# EAGLE schematic InkTime_Schematic (EAGLE 9.7.0)

## Sheet 1 of 2
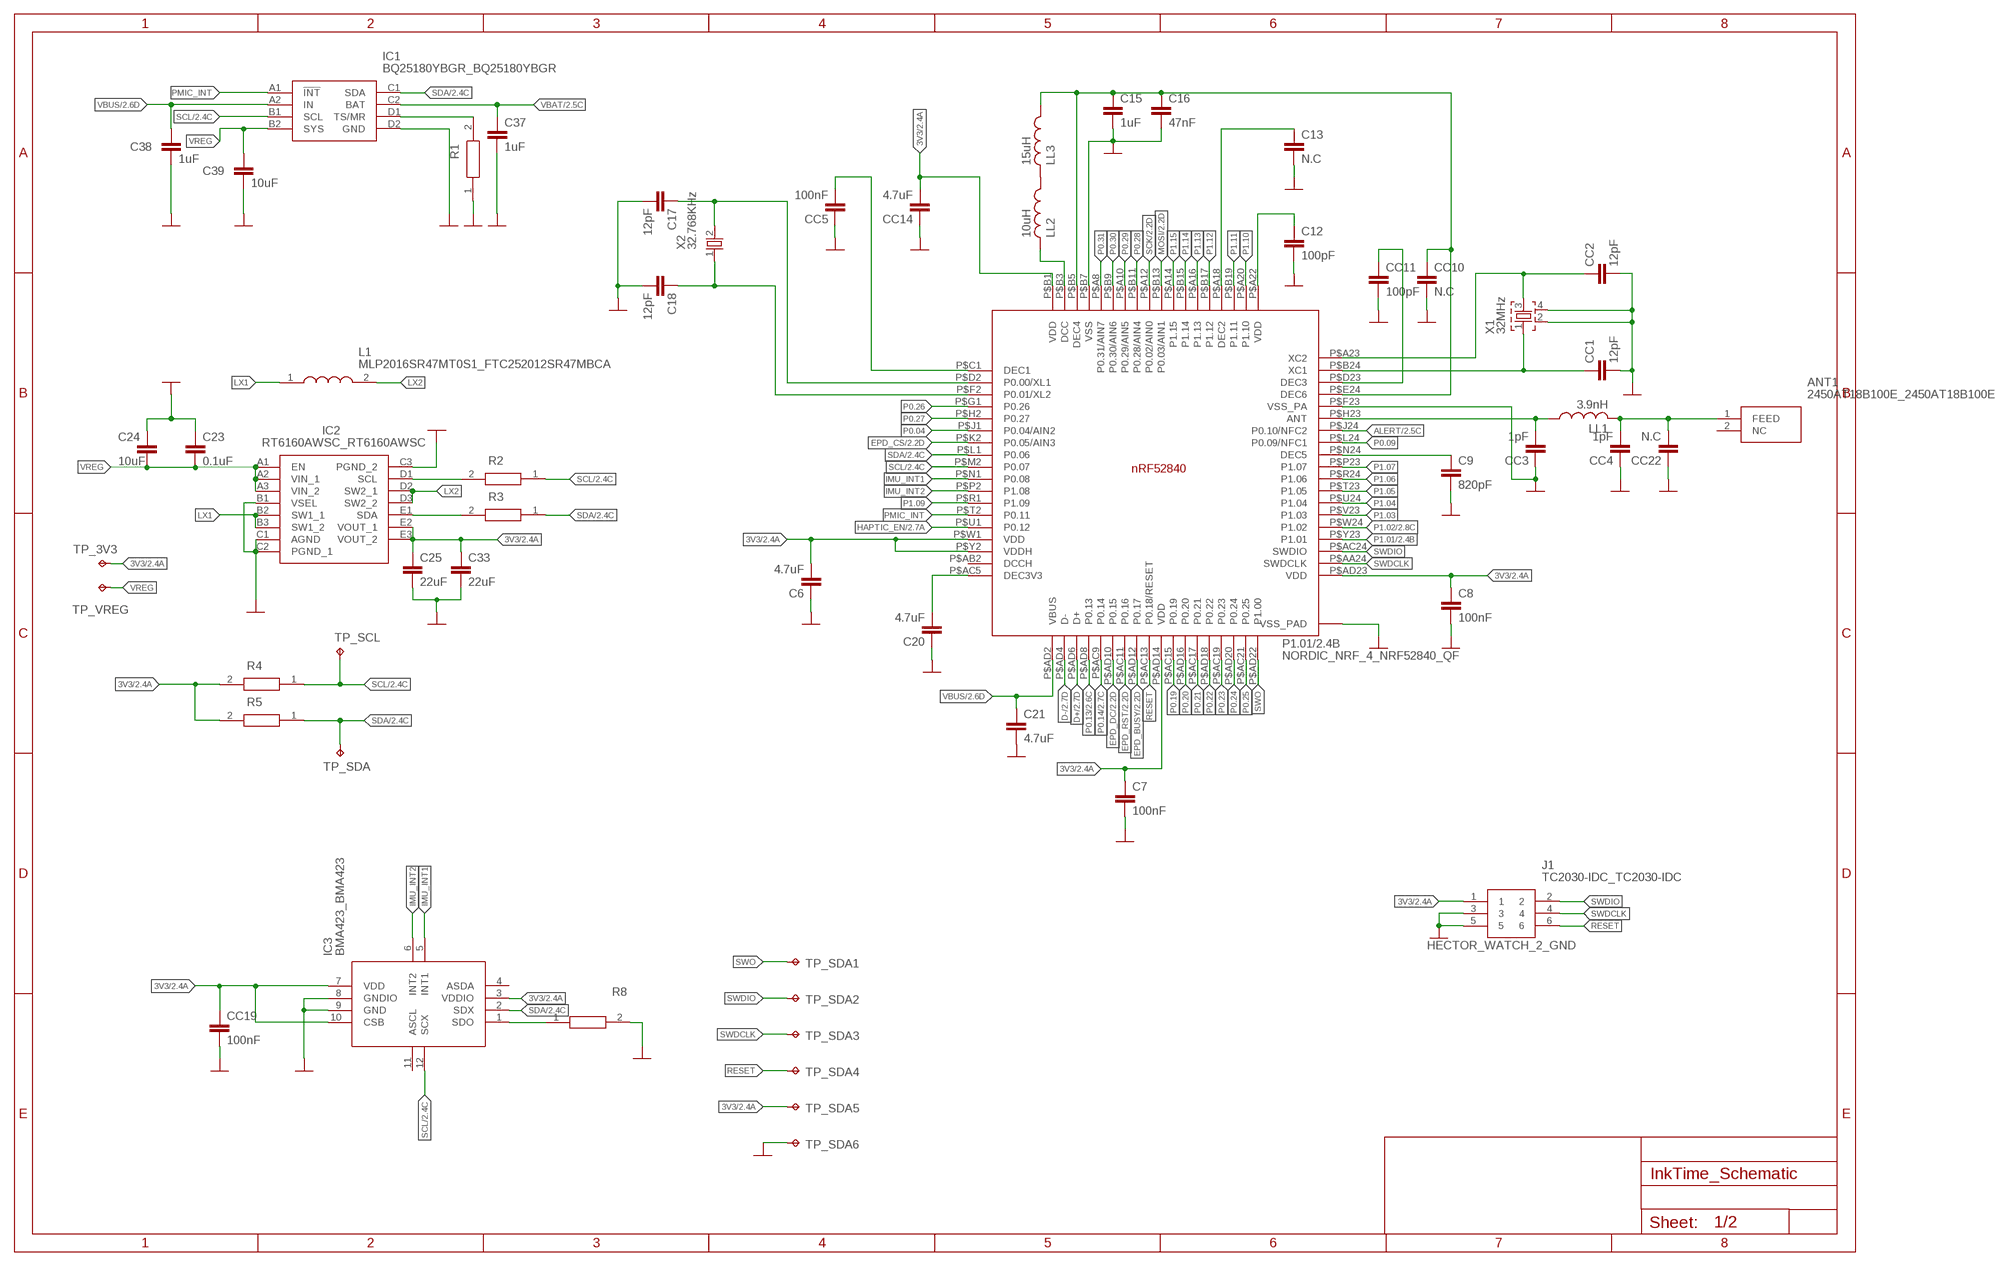
[diagram p0: schematic, sheet 1]

### Parts
ANT1  2450AT18B100E_2450AT18B100E  [2450AT18B100E_ANTC3216X140N]
C6  4.7uF  NORDIC_NRF_3_CAPACITOR_0402_M  [NORDIC_NRF_3_RESC0402_M]
C7  100nF  NORDIC_NRF_3_CAPACITOR_0402_M  [NORDIC_NRF_3_RESC0402_M]
C8  100nF  NORDIC_NRF_3_CAPACITOR_0402_M  [NORDIC_NRF_3_RESC0402_M]
C9  820pF  NORDIC_NRF_3_CAPACITOR_0402_M  [NORDIC_NRF_3_RESC0402_M]
C12  100pF  NORDIC_NRF_3_CAPACITOR_0402_M  [NORDIC_NRF_3_RESC0402_M]
C13  N.C  NORDIC_NRF_3_CAPACITOR_0402_M  [NORDIC_NRF_3_RESC0402_M]
C15  1uF  NORDIC_NRF_3_CAPACITOR_0402_M  [NORDIC_NRF_3_RESC0402_M]
C16  47nF  NORDIC_NRF_3_CAPACITOR_0402_M  [NORDIC_NRF_3_RESC0402_M]
C17  12pF  NORDIC_NRF_3_CAPACITOR_0402_M  [NORDIC_NRF_3_RESC0402_M]
C18  12pF  NORDIC_NRF_3_CAPACITOR_0402_M  [NORDIC_NRF_3_RESC0402_M]
C20  4.7uF  NORDIC_NRF_3_CAPACITOR_0402_M  [NORDIC_NRF_3_RESC0402_M]
C21  4.7uF  NORDIC_NRF_3_CAPACITOR_0402_M  [NORDIC_NRF_3_RESC0402_M]
C23  0.1uF  NORDIC_NRF_3_CAPACITOR_0402_M  [NORDIC_NRF_3_RESC0402_M]
C24  10uF  NORDIC_NRF_3_CAPACITOR_0402_M  [NORDIC_NRF_3_RESC0402_M]
C25  22uF  NORDIC_NRF_3_CAPACITOR_0402_M  [NORDIC_NRF_3_RESC0402_M]
C33  22uF  NORDIC_NRF_3_CAPACITOR_0402_M  [NORDIC_NRF_3_RESC0402_M]
C37  1uF  NORDIC_NRF_3_CAPACITOR_0402_M  [NORDIC_NRF_3_RESC0402_M]
C38  1uF  NORDIC_NRF_3_CAPACITOR_0402_M  [NORDIC_NRF_3_RESC0402_M]
C39  10uF  NORDIC_NRF_3_CAPACITOR_0402_M  [NORDIC_NRF_3_RESC0402_M]
CC1  12pF  NORDIC_NRF_3_CAPACITOR_0402_M  [NORDIC_NRF_3_RESC0402_M]
CC2  12pF  NORDIC_NRF_3_CAPACITOR_0402_M  [NORDIC_NRF_3_RESC0402_M]
CC3  1pF  NORDIC_NRF_3_CAPACITOR_0402_M  [NORDIC_NRF_3_RESC0402_M]
CC4  1pF  NORDIC_NRF_3_CAPACITOR_0402_M  [NORDIC_NRF_3_RESC0402_M]
CC5  100nF  NORDIC_NRF_3_CAPACITOR_0402_M  [NORDIC_NRF_3_RESC0402_M]
CC10  N.C  NORDIC_NRF_3_CAPACITOR_0402_M  [NORDIC_NRF_3_RESC0402_M]
CC11  100pF  NORDIC_NRF_3_CAPACITOR_0402_M  [NORDIC_NRF_3_RESC0402_M]
CC14  4.7uF  NORDIC_NRF_3_CAPACITOR_0402_M  [NORDIC_NRF_3_RESC0402_M]
CC19  100nF  NORDIC_NRF_3_CAPACITOR_0402_M  [NORDIC_NRF_3_RESC0402_M]
CC22  N.C  NORDIC_NRF_3_CAPACITOR_0402_M  [NORDIC_NRF_3_RESC0402_M]
IC1  BQ25180YBGR_BQ25180YBGR  [BQ25180YBGR_BGA8C40P2X4_100X155X50]
IC2  RT6160AWSC_RT6160AWSC  [RT6160AWSC_BGA15C40P3X5_140X230X60]
IC3  BMA423_BMA423  [BMA423_BMA423]
J1  TC2030-IDC_TC2030-IDC  [TC2030-IDC_TC2030IDC]
L1  MLP2016SR47MT0S1_FTC252012SR47MBCA  [MLP2016SR47MT0S1_INDC2016X100N]
LL1  3.9nH  NORDIC_NRF_2_INDUCTOR_0402_M  [NORDIC_NRF_2_RESC0402_M]
LL2  10uH  NORDIC_NRF_2_INDUCTOR_0402_M  [NORDIC_NRF_2_RESC0402_M]
LL3  15uH  NORDIC_NRF_2_INDUCTOR_0402_M  [NORDIC_NRF_2_RESC0402_M]
P1.01/2.4B  NORDIC_NRF_4_NRF52840_QF  [NORDIC_NRF_4_AQFN50P700X700X85_HS-74N]
R1  10K  CPF0201D7K68C1_CPF0201D7K68C1  [CPF0201D7K68C1_0201]
R2  CPF0201D7K68C1_CPF0201D7K68C1  [CPF0201D7K68C1_0201]
R3  CPF0201D7K68C1_CPF0201D7K68C1  [CPF0201D7K68C1_0201]
R4  CPF0201D7K68C1_CPF0201D7K68C1  [CPF0201D7K68C1_0201]
R5  CPF0201D7K68C1_CPF0201D7K68C1  [CPF0201D7K68C1_0201]
R8  CPF0201D7K68C1_CPF0201D7K68C1  [CPF0201D7K68C1_0201]
TP_3V3  HECTOR_WATCH_1_TPTP20R  [HECTOR_WATCH_1_TP20R]
TP_SCL  HECTOR_WATCH_1_TPTP20R  [HECTOR_WATCH_1_TP20R]
TP_SDA  HECTOR_WATCH_1_TPTP20R  [HECTOR_WATCH_1_TP20R]
TP_SDA1  HECTOR_WATCH_1_TPTP20R  [HECTOR_WATCH_1_TP20R]
TP_SDA2  HECTOR_WATCH_1_TPTP20R  [HECTOR_WATCH_1_TP20R]
TP_SDA3  HECTOR_WATCH_1_TPTP20R  [HECTOR_WATCH_1_TP20R]
TP_SDA4  HECTOR_WATCH_1_TPTP20R  [HECTOR_WATCH_1_TP20R]
TP_SDA5  HECTOR_WATCH_1_TPTP20R  [HECTOR_WATCH_1_TP20R]
TP_SDA6  HECTOR_WATCH_1_TPTP20R  [HECTOR_WATCH_1_TP20R]
TP_VREG  HECTOR_WATCH_1_TPTP20R  [HECTOR_WATCH_1_TP20R]
X1  32MHz  NORDIC_NRF_XTAL_32MHZ  [NORDIC_NRF_BT-XTAL_2016_N]
X2  32.768KHz  NORDIC_NRF_1_XTAL_32KHZ  [NORDIC_NRF_1_XTAL_3215_N]

### Nets
3V3/2.4A: C6.2 C7.1 C8.1 C25.1 C33.1 CC14.2 CC19.1 IC2.E2(VOUT_1) IC2.E3(VOUT_2) IC3.3(VDDIO) IC3.7(VDD) IC3.10(CSB) J1.1 P1.01/2.4B.P$AD14(VDD) P1.01/2.4B.P$AD23(VDD) P1.01/2.4B.P$B1(VDD) P1.01/2.4B.P$W1(VDD) P1.01/2.4B.P$Y2(VDDH) R4.2 R5.2 TP_3V3.TP TP_SDA5.TP
ALERT: P1.01/2.4B.P$J24(P0.10/NFC2) ; also sheet 2
D+: P1.01/2.4B.P$AD6(D+) ; also sheet 2
D-: P1.01/2.4B.P$AD4(D-) ; also sheet 2
EPD_BUSY: P1.01/2.4B.P$AD12(P0.17) ; also sheet 2
EPD_CS: P1.01/2.4B.P$K2(P0.05/AIN3) ; also sheet 2
EPD_DC: P1.01/2.4B.P$AD10(P0.15) ; also sheet 2
EPD_RST: P1.01/2.4B.P$AC11(P0.16) ; also sheet 2
GND: C6.1 C7.2 C8.2 C9.2 C12.2 C13.2 C15.2 C16.2 C17.2 C18.2 C20.1 C21.2 C23.1 C24.1 C25.2 C33.2 C37.2 C38.2 C39.2 CC1.2 CC2.2 CC3.1 CC4.1 CC5.1 CC10.2 CC11.2 CC14.1 CC19.2 CC22.1 IC1.D2(GND) IC2.B1(VSEL) IC2.C1(AGND) IC2.C2(PGND_1) IC2.C3(PGND_2) IC3.8(GNDIO) IC3.9(GND) J1.3 J1.5 P1.01/2.4B.P$74(VSS_PAD) P1.01/2.4B.P$75(VSS_PAD) P1.01/2.4B.P$76(VSS_PAD) P1.01/2.4B.P$77(VSS_PAD) P1.01/2.4B.P$78(VSS_PAD) P1.01/2.4B.P$79(VSS_PAD) P1.01/2.4B.P$80(VSS_PAD) P1.01/2.4B.P$81(VSS_PAD) P1.01/2.4B.P$82(VSS_PAD) P1.01/2.4B.P$83(VSS_PAD) P1.01/2.4B.P$84(VSS_PAD) P1.01/2.4B.P$85(VSS_PAD) P1.01/2.4B.P$86(VSS_PAD) P1.01/2.4B.P$87(VSS_PAD) P1.01/2.4B.P$88(VSS_PAD) P1.01/2.4B.P$89(VSS_PAD) P1.01/2.4B.P$90(VSS_PAD) P1.01/2.4B.P$B7(VSS) P1.01/2.4B.P$F23(VSS_PA) R1.1 R8.2 TP_SDA6.TP X1.2 X1.4 ; supply symbol labelled HECTOR_WATCH_2_GND ; also sheet 2
HAPTIC_EN: P1.01/2.4B.P$U1(P0.12) ; also sheet 2
IMU_INT1: IC3.5(INT1) P1.01/2.4B.P$N1(P0.08)
IMU_INT2: IC3.6(INT2) P1.01/2.4B.P$P2(P1.08)
LX1: IC2.B2(SW1_1) IC2.B3(SW1_2) L1.1
LX2: IC2.D2(SW2_1) IC2.D3(SW2_2) L1.2
MOSI: P1.01/2.4B.P$B13(P0.03/AIN1) ; also sheet 2
N$1: IC1.D1(TS/MR) R1.2
N$2: C9.1 P1.01/2.4B.P$N24(DEC5)
N$3: CC3.2 LL1.1 P1.01/2.4B.P$H23(ANT)
N$4: IC2.D1(SCL) R2.2
N$5: IC2.E1(SDA) R3.2
N$6: C20.2 P1.01/2.4B.P$AC5(DEC3V3)
N$7: ANT1.1(FEED) CC4.2 CC22.2 LL1.2
N$8: CC1.1 P1.01/2.4B.P$B24(XC1) X1.1
N$9: CC2.1 P1.01/2.4B.P$A23(XC2) X1.3
N$10: CC11.1 P1.01/2.4B.P$D23(DEC3)
N$11: C18.1 P1.01/2.4B.P$F2(P0.01/XL2) X2.1
N$12: C12.1 P1.01/2.4B.P$A22(VDD)
N$13: C13.1 P1.01/2.4B.P$A18(DEC2)
N$14: LL2.1 LL3.2
N$15: LL2.2 P1.01/2.4B.P$B3(DCC)
N$17: C15.1 C16.1 CC10.1 LL3.1 P1.01/2.4B.P$B5(DEC4) P1.01/2.4B.P$E24(DEC6)
N$18: C17.1 P1.01/2.4B.P$D2(P0.00/XL1) X2.2
N$19: IC3.1(SDO) R8.1
N$20: CC5.2 P1.01/2.4B.P$C1(DEC1)
P0.04: P1.01/2.4B.P$J1(P0.04/AIN2)
P0.09: P1.01/2.4B.P$L24(P0.09/NFC1)
P0.13: P1.01/2.4B.P$AD8(P0.13) ; also sheet 2
P0.14: P1.01/2.4B.P$AC9(P0.14) ; also sheet 2
P0.19: P1.01/2.4B.P$AC15(P0.19)
P0.20: P1.01/2.4B.P$AD16(P0.20)
P0.21: P1.01/2.4B.P$AC17(P0.21)
P0.22: P1.01/2.4B.P$AD18(P0.22)
P0.23: P1.01/2.4B.P$AC19(P0.23)
P0.24: P1.01/2.4B.P$AD20(P0.24)
P0.25: P1.01/2.4B.P$AC21(P0.25)
P0.26: P1.01/2.4B.P$G1(P0.26)
P0.27: P1.01/2.4B.P$H2(P0.27)
P0.28: P1.01/2.4B.P$B11(P0.28/AIN4)
P0.29: P1.01/2.4B.P$A10(P0.29/AIN5)
P0.30: P1.01/2.4B.P$B9(P0.30/AIN6)
P0.31: P1.01/2.4B.P$A8(P0.31/AIN7)
P1.01: P1.01/2.4B.P$Y23(P1.01) ; also sheet 2
P1.02: P1.01/2.4B.P$W24(P1.02) ; also sheet 2
P1.03: P1.01/2.4B.P$V23(P1.03)
P1.04: P1.01/2.4B.P$U24(P1.04)
P1.05: P1.01/2.4B.P$T23(P1.05)
P1.06: P1.01/2.4B.P$R24(P1.06)
P1.07: P1.01/2.4B.P$P23(P1.07)
P1.09: P1.01/2.4B.P$R1(P1.09)
P1.10: P1.01/2.4B.P$A20(P1.10)
P1.11: P1.01/2.4B.P$B19(P1.11)
P1.12: P1.01/2.4B.P$B17(P1.12)
P1.13: P1.01/2.4B.P$A16(P1.13)
P1.14: P1.01/2.4B.P$B15(P1.14)
P1.15: P1.01/2.4B.P$A14(P1.15)
PMIC_INT: IC1.A1(!INT) P1.01/2.4B.P$T2(P0.11)
RESET: J1.6 P1.01/2.4B.P$AC13(P0.18/RESET) TP_SDA4.TP
SCK: P1.01/2.4B.P$A12(P0.02/AIN0) ; also sheet 2
SCL/2.4C: IC1.B1(SCL) IC3.12(SCX) P1.01/2.4B.P$M2(P0.07) R2.1 R4.1 TP_SCL.TP
SDA/2.4C: IC1.C1(SDA) IC3.2(SDX) P1.01/2.4B.P$L1(P0.06) R3.1 R5.1 TP_SDA.TP
SWDCLK: J1.4 P1.01/2.4B.P$AA24(SWDCLK) TP_SDA3.TP
SWDIO: J1.2 P1.01/2.4B.P$AC24(SWDIO) TP_SDA2.TP
SWO: P1.01/2.4B.P$AD22(P1.00) TP_SDA1.TP
VBAT/2.5C: C37.1 IC1.C2(BAT)
VBUS/2.6D: C21.1 C38.1 IC1.A2(IN) P1.01/2.4B.P$AD2(VBUS)
VREG: C23.2 C24.2 C39.1 IC1.B2(SYS) IC2.A1(EN) IC2.A2(VIN_1) IC2.A3(VIN_2) TP_VREG.TP
Unconnected: ANT1.2(NC) IC3.4(ASDA) IC3.11(ASCL) P1.01/2.4B.P$AB2(DCCH)

## Sheet 2 of 2
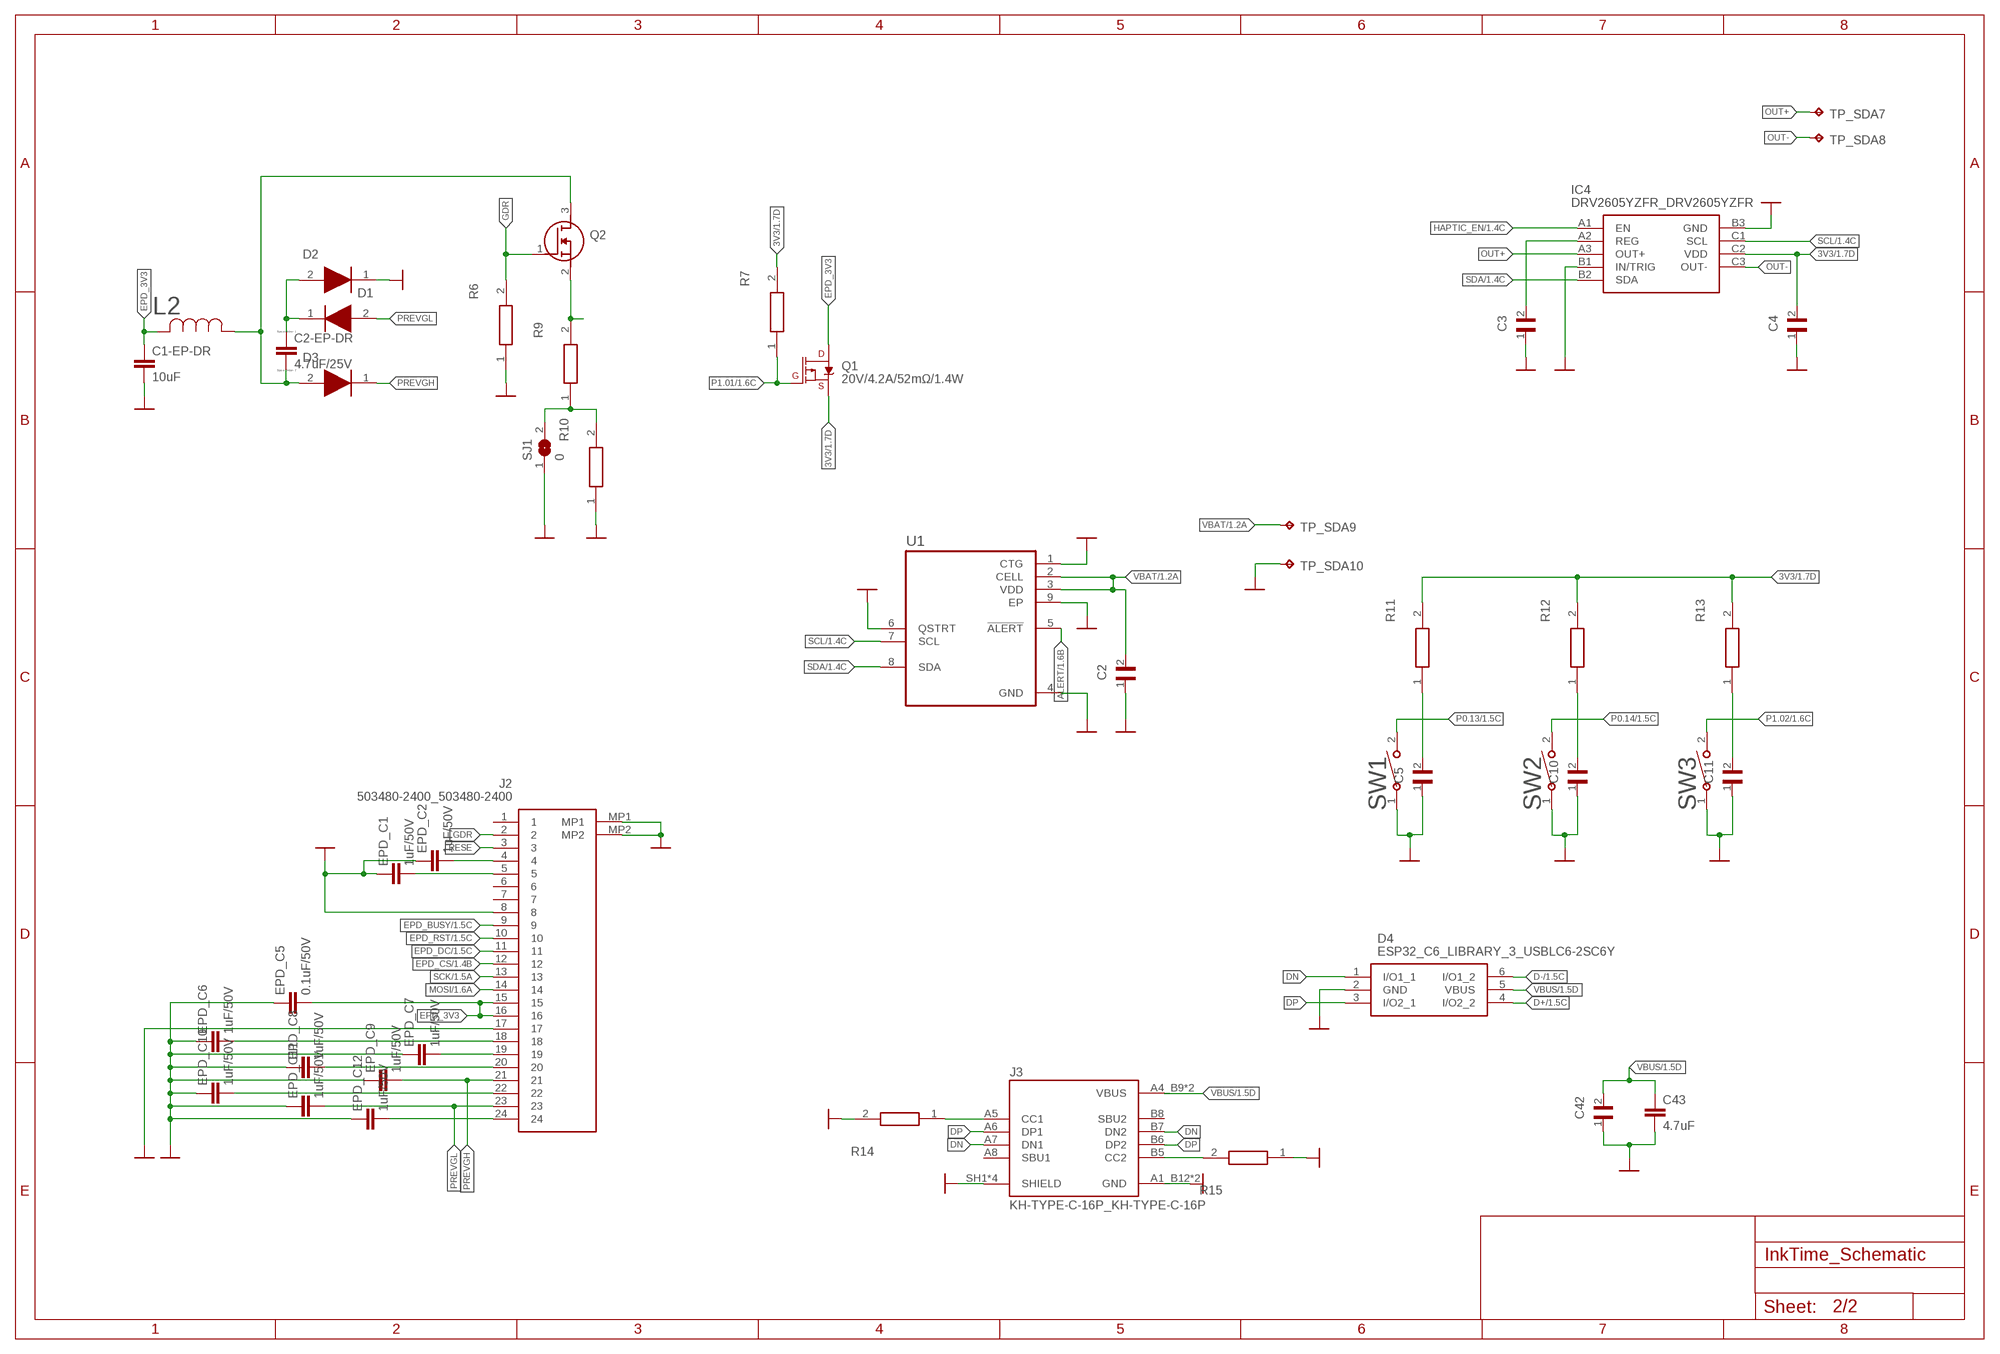
[diagram p1: schematic, sheet 2]

### Parts
C1-EP-DR  10uF  NORDIC_NRF_3_CAPACITOR_0402_M  [NORDIC_NRF_3_RESC0402_M]
C2  GRM011R60J152KE01L_1_GRM011R60J152KE01L  [GRM011R60J152KE01L_1_0201]
C2-EP-DR  4.7uF/25V  ESP32_C6_LIBRARY_1_ESP32_WROVER_EAGLE-LTSPICE_CC0402  [ESP32_C6_LIBRARY_1_ESP32_WROVER_EAGLE-LTSPICE_C0402]
C3  1uF  GRM011R60J152KE01L_1_GRM011R60J152KE01L  [GRM011R60J152KE01L_1_0201]
C4  0.1uF  GRM011R60J152KE01L_1_GRM011R60J152KE01L  [GRM011R60J152KE01L_1_0201]
C5  GRM011R60J152KE01L_1_GRM011R60J152KE01L  [GRM011R60J152KE01L_1_0201]
C10  GRM011R60J152KE01L_1_GRM011R60J152KE01L  [GRM011R60J152KE01L_1_0201]
C11  GRM011R60J152KE01L_1_GRM011R60J152KE01L  [GRM011R60J152KE01L_1_0201]
C42  GRM011R60J152KE01L_1_GRM011R60J152KE01L  [GRM011R60J152KE01L_1_0201]
C43  4.7uF  NORDIC_NRF_3_CAPACITOR_0402_M  [NORDIC_NRF_3_RESC0402_M]
D1  ESP32_C6_LIBRARY_5_MBR0530  [ESP32_C6_LIBRARY_5_SOD3716X135N]
D2  ESP32_C6_LIBRARY_5_MBR0530  [ESP32_C6_LIBRARY_5_SOD3716X135N]
D3  ESP32_C6_LIBRARY_5_MBR0530  [ESP32_C6_LIBRARY_5_SOD3716X135N]
D4  ESP32_C6_LIBRARY_3_USBLC6-2SC6Y  [ESP32_C6_LIBRARY_3_SOT95P280X145-6N]
EPD_C1  1uF/50V  NORDIC_NRF_3_CAPACITOR_0402_M  [NORDIC_NRF_3_RESC0402_M]
EPD_C2  1uF/50V  NORDIC_NRF_3_CAPACITOR_0402_M  [NORDIC_NRF_3_RESC0402_M]
EPD_C5  0.1uF/50V  NORDIC_NRF_3_CAPACITOR_0402_M  [NORDIC_NRF_3_RESC0402_M]
EPD_C6  1uF/50V  NORDIC_NRF_3_CAPACITOR_0402_M  [NORDIC_NRF_3_RESC0402_M]
EPD_C7  1uF/50V  NORDIC_NRF_3_CAPACITOR_0402_M  [NORDIC_NRF_3_RESC0402_M]
EPD_C8  1uF/50V  NORDIC_NRF_3_CAPACITOR_0402_M  [NORDIC_NRF_3_RESC0402_M]
EPD_C9  1uF/50V  NORDIC_NRF_3_CAPACITOR_0402_M  [NORDIC_NRF_3_RESC0402_M]
EPD_C10  1uF/50V  NORDIC_NRF_3_CAPACITOR_0402_M  [NORDIC_NRF_3_RESC0402_M]
EPD_C11  1uF/50V  NORDIC_NRF_3_CAPACITOR_0402_M  [NORDIC_NRF_3_RESC0402_M]
EPD_C12  1uF/50V  NORDIC_NRF_3_CAPACITOR_0402_M  [NORDIC_NRF_3_RESC0402_M]
IC4  DRV2605YZFR_DRV2605YZFR  [DRV2605YZFR_BGA9C50P3X3_144X144X62]
J2  503480-2400_503480-2400  [503480-2400_5034802400]
J3  KH-TYPE-C-16P_KH-TYPE-C-16P  [KH-TYPE-C-16P_KINGHELM_KH-TYPE-C-16P]
L2  ESP32_C6_LIBRARY_2_744043680IND_4828-WE-TPC_WRE  [ESP32_C6_LIBRARY_2_IND_4828-WE-TPC_WRE]
Q1  20V/4.2A/52mΩ/1.4W  ESP32_C6_LIBRARY_4_ESP32_WROVER_SPARKFUN-DISCRETESEMI_MOSFET_PCH-DMG2305UX-7  [ESP32_C6_LIBRARY_4_ESP32_C6_LIBRARY_4_ESP32_C6_LIBRARY_4_ESP32_C6_LIBRARY_4_ESP32_WROVER_SPARKFUN-DISCRETESEMI_SOT23-3]
Q2  ESP32_C6_LIBRARY_6_SI1308EDL-T1-GE3  [ESP32_C6_LIBRARY_6_SOT65P210X110-3N]
R6  CPF0201D7K68C1_CPF0201D7K68C1  [CPF0201D7K68C1_0201]
R7  CPF0201D7K68C1_CPF0201D7K68C1  [CPF0201D7K68C1_0201]
R9  CPF0201D7K68C1_CPF0201D7K68C1  [CPF0201D7K68C1_0201]
R10  CPF0201D7K68C1_CPF0201D7K68C1  [CPF0201D7K68C1_0201]
R11  CPF0201D7K68C1_CPF0201D7K68C1  [CPF0201D7K68C1_0201]
R12  CPF0201D7K68C1_CPF0201D7K68C1  [CPF0201D7K68C1_0201]
R13  CPF0201D7K68C1_CPF0201D7K68C1  [CPF0201D7K68C1_0201]
R14  CPF0201D7K68C1_CPF0201D7K68C1  [CPF0201D7K68C1_0201]
R15  CPF0201D7K68C1_CPF0201D7K68C1  [CPF0201D7K68C1_0201]
SJ1  0  ESP32_C6_LIBRARY_7_JUMPER_SJ  [ESP32_C6_LIBRARY_7_JUMPER_SJ]
SW1  2025-10-22_07-23-44_LIBRARY_EVP-AKE31ASW_EVP-AKE31A_PAN  [2025-10-22_07-23-44_LIBRARY_SW_EVP-AKE31A_PAN]
SW2  2025-10-22_07-23-44_LIBRARY_EVP-AKE31ASW_EVP-AKE31A_PAN  [2025-10-22_07-23-44_LIBRARY_SW_EVP-AKE31A_PAN]
SW3  2025-10-22_07-23-44_LIBRARY_EVP-AKE31ASW_EVP-AKE31A_PAN  [2025-10-22_07-23-44_LIBRARY_SW_EVP-AKE31A_PAN]
TP_SDA7  HECTOR_WATCH_1_TPTP20R  [HECTOR_WATCH_1_TP20R]
TP_SDA8  HECTOR_WATCH_1_TPTP20R  [HECTOR_WATCH_1_TP20R]
TP_SDA9  HECTOR_WATCH_1_TPTP20R  [HECTOR_WATCH_1_TP20R]
TP_SDA10  HECTOR_WATCH_1_TPTP20R  [HECTOR_WATCH_1_TP20R]
U1  ESP32_C6_LIBRARY_MAX17048G+T10  [ESP32_C6_LIBRARY_SON50P200X200X80-9N]

### Nets
3V3/1.7D: C4.2 IC4.C2(VDD) Q1.2(S) R7.2 R11.2 R12.2 R13.2
ALERT: U1.5(!ALERT) ; also sheet 1
D+: D4.4(I/O2_2) ; also sheet 1
D-: D4.6(I/O1_2) ; also sheet 1
DN: D4.1(I/O1_1) J3.A7(DN1) J3.B7(DN2)
DP: D4.3(I/O2_1) J3.A6(DP1) J3.B6(DP2)
EPD_3V3: C1-EP-DR.1 EPD_C5.2 J2.15 J2.16 L2.2 Q1.3(D)
EPD_BUSY: J2.9 ; also sheet 1
EPD_CS: J2.12 ; also sheet 1
EPD_DC: J2.11 ; also sheet 1
EPD_RST: J2.10 ; also sheet 1
GDR: J2.2 Q2.1(G) R6.2
GND: C1-EP-DR.2 C2.1 C3.1 C4.1 C5.1 C10.1 C11.1 C42.1 C43.2 D2.1(K) D4.2(GND) EPD_C1.1 EPD_C2.1 EPD_C5.1 EPD_C6.1 EPD_C7.1 EPD_C8.1 EPD_C9.1 EPD_C10.1 EPD_C11.1 EPD_C12.1 IC4.B1(IN/TRIG) IC4.B3(GND) J2.8 J2.17 J2.MP1 J2.MP2 J3.A1_B12(GND) J3.A12_B1(GND) J3.SH1(SHIELD) J3.SH2(SHIELD) J3.SH3(SHIELD) J3.SH4(SHIELD) R6.1 R10.1 R14.2 R15.1 SJ1.1 SW1.1 SW2.1 SW3.1 TP_SDA10.TP U1.1(CTG) U1.4(GND) U1.6(QSTRT) U1.9(EP) ; supply symbol labelled HECTOR_WATCH_2_GND ; also sheet 1
HAPTIC_EN: IC4.A1(EN) ; also sheet 1
MOSI: J2.14 ; also sheet 1
N$21: C2-EP-DR.1 D1.1(K) D2.2(A)
N$22: Q2.2(S) R9.2
N$23: R9.1 R10.2 SJ1.2
N$24: C2-EP-DR.2 D3.2(A) L2.1 Q2.3(D)
N$25: EPD_C2.2 J2.4
N$26: EPD_C1.2 J2.5
N$27: J3.B5(CC2) R15.2
N$28: EPD_C7.2 J2.19
N$29: C5.2 R11.1
N$30: EPD_C12.2 J2.24
N$31: EPD_C6.2 J2.18
N$32: EPD_C8.2 J2.20
N$33: C10.2 R12.1
N$34: EPD_C10.2 J2.22
N$35: C11.2 R13.1
N$36: J3.A5(CC1) R14.1
N$37: C3.2 IC4.A2(REG)
OUT+: IC4.A3(OUT+) TP_SDA7.TP
OUT-: IC4.C3(OUT-) TP_SDA8.TP
P0.13: SW1.2 ; also sheet 1
P0.14: SW2.2 ; also sheet 1
P1.01: Q1.1(G) R7.1 ; also sheet 1
P1.02: SW3.2 ; also sheet 1
PREVGH: D3.1(K) EPD_C9.2 J2.21
PREVGL: D1.2(A) EPD_C11.2 J2.23
RESE: J2.3
SCK: J2.13 ; also sheet 1
SCL/1.4C: IC4.C1(SCL) U1.7(SCL)
SDA/1.4C: IC4.B2(SDA) U1.8(SDA)
VBAT/1.2A: C2.2 TP_SDA9.TP U1.2(CELL) U1.3(VDD)
VBUS/1.5D: C42.2 C43.1 D4.5(VBUS) J3.A4_B9(VBUS) J3.A9_B4(VBUS)
Unconnected: J2.1 J2.6 J2.7 J3.A8(SBU1) J3.B8(SBU2)

## Library data of the parts
ANT1 = InkTime_v5:2450AT18B100E_2450AT18B100E: Antennas 2.45GHz ANTENNA Source: Datasheet <https://www.johansontechnology.com/datasheets/2450AT18B100/2450AT18B100.pdf>; ARROW_PART_NUMBER: 2450AT18B100E; ARROW_PRICE-STOCK: https://www.arrow.com/en/products/2450at18b100e/johanson-dielectrics?utm_currency=USD&region=nac; DESCRIPTION: Antennas 2.45GHz ANTENNA; HEIGHT: 1.4mm; MANUFACTURER_NAME: JOHANSON TECHNOLOGY; MANUFACTURER_PART_NUMBER: 2450AT18B100E; MOUSER_PART_NUMBER: 609-2450AT18B100E; MOUSER_PRICE-STOCK: https://www.mouser.co.uk/ProductDetail/Johanson-Technology/2450AT18B100E?qs=yCnrNFeXz%252Bh5MFsFIXGZGA%3D%3D
C1-EP-DR C6-C9 C12 C13 C15-C18 C20 C21 C23-C25 C33 C37-C39 C43 CC1-CC5 CC10 CC11 CC14 CC19 CC22 EPD_C1 EPD_C2 EPD_C5-EPD_C12 = InkTime_v5:NORDIC_NRF_3_CAPACITOR: Generic chip capacitor
C2-C5 C10 C11 C42 = InkTime_v5:GRM011R60J152KE01L_1_GRM011R60J152KE01L: Check availability <https://pricing.snapeda.com/parts/GRM011R60J152KE01L/Murata/view-part?ref=eda>
C2-EP-DR = InkTime_v5:ESP32_C6_LIBRARY_1_ESP32_WROVER_EAGLE-LTSPICE_C: CAPACITOR, European symbol; SPICEMODEL: NONE; SPICEPREFIX: C
D1-D3 = InkTime_v5:ESP32_C6_LIBRARY_5_MBR0530: ON SEMICONDUCTOR - MBR0530 - DIODE, SCHOTTKY, 0.5A, 30V, SOD-123 Source: Datasheet <http://www.onsemi.com/pub/Collateral/MBR0530T1-D.PDF> Check availability <https://pricing.snapeda.com/parts/MBR0530/ON%20Semiconductor/view-part?ref=eda>; AVAILABILITY: In Stock; CHECK_PRICES: https://www.snapeda.com/parts/MBR0530/Onsemi/view-part/?ref=eda; DESCRIPTION: Diode Schottky 30 V 500mA Surface Mount SOD-123; MF: ON Semiconductor; MP: MBR0530; PACKAGE: SOD-123-2 ON Semiconductor; PRICE: None; PURCHASE-URL: https://www.snapeda.com/api/url_track_click_mouser/?unipart_id=179458&manufacturer=ON Semiconductor&part_name=MBR0530&search_term=None; SNAPEDA_LINK: https://www.snapeda.com/parts/MBR0530/Onsemi/view-part/?ref=snap
D4 = InkTime_v5:ESP32_C6_LIBRARY_3_USBLC6-2SC6Y: Low Cap. ESD Protection Auto SOT-23-6 STMicroelectronics USBLC6-2SC6Y, Dual Uni-Directional TVS Diode Array, 6-Pin SOT-23 Source: Datasheet <https://componentsearchengine.com/Datasheets/1/USBLC6-2SC6Y.pdf> Check availability <https://pricing.snapeda.com/parts/USBLC6-2SC6Y/STMicroelectronics/view-part?ref=eda>; AVAILABILITY: In Stock; CHECK_PRICES: https://www.snapeda.com/parts/USBLC6-2SC6Y/STMicroelectronics/view-part/?ref=eda; DESCRIPTION: 17V Clamp 5A (8/20µs) Ipp Tvs Diode Surface Mount SOT-23-6; MF: STMicroelectronics; MP: USBLC6-2SC6Y; PACKAGE: SOT-23-6 STMicroelectronics; PRICE: None; SNAPEDA_LINK: https://www.snapeda.com/parts/USBLC6-2SC6Y/STMicroelectronics/view-part/?ref=snap
IC1 = InkTime_v5:BQ25180YBGR_BQ25180YBGR: Charger IC Lithium Ion/Polymer, Lithium Iron Phosphate 8-DSBGA (1.6x1.1) Source: Datasheet <https://www.ti.com/lit/ds/symlink/bq25180.pdf?ts=1650264094470&ref_url=https%3A%2F%2Fwww.ti.com%2Fproduct%2FBQ25180>; ARROW_PART_NUMBER: BQ25180YBGR; ARROW_PRICE-STOCK: https://www.arrow.com/en/products/bq25180ybgr/texas-instruments?utm_currency=USD&region=nac; DESCRIPTION: Charger IC Lithium Ion/Polymer, Lithium Iron Phosphate 8-DSBGA (1.6x1.1); HEIGHT: 0.5mm; MANUFACTURER_NAME: Texas Instruments; MANUFACTURER_PART_NUMBER: BQ25180YBGR; MOUSER_PART_NUMBER: 595-BQ25180YBGR; MOUSER_PRICE-STOCK: https://www.mouser.co.uk/ProductDetail/Texas-Instruments/BQ25180YBGR?qs=doiCPypUmgEWjAK%252BJAX6Tw%3D%3D
IC2 = InkTime_v5:RT6160AWSC_RT6160AWSC: Buck-Boost Regulator Positive Output Step-Up/Step-Down I2C DC-DC Controller IC 15-WL-CSP (BSC) (1.4x2.3) Source: Datasheet <https://www.richtek.com/SaveDownload.aspx?specid=RT6160A>; DESCRIPTION: Buck-Boost Regulator Positive Output Step-Up/Step-Down I2C DC-DC Controller IC 15-WL-CSP (BSC) (1.4x2.3); HEIGHT: 0.6mm; MANUFACTURER_NAME: RICHTEK; MANUFACTURER_PART_NUMBER: RT6160AWSC; MOUSER_PART_NUMBER: 835-RT6160AWSC; MOUSER_PRICE-STOCK: https://www.mouser.co.uk/ProductDetail/Richtek/RT6160AWSC?qs=amGC7iS6iy%2FLd9PSoixZXQ%3D%3D
IC3 = InkTime_v5:BMA423_BMA423: Accelerometers Triaxial low-g 12bit Acceleration Sensor Source: Datasheet <https://www.mouser.com/datasheet/2/783/BST-BMA423-DS000-1509600.pdf>; ARROW_PART_NUMBER: BMA423; ARROW_PRICE-STOCK: https://www.arrow.com/en/products/bma423/bosch; DESCRIPTION: Accelerometers Triaxial low-g 12bit Acceleration Sensor; HEIGHT: 1mm; MANUFACTURER_NAME: BOSCH; MANUFACTURER_PART_NUMBER: BMA423; MOUSER_PART_NUMBER: 262-BMA423; MOUSER_PRICE-STOCK: https://www.mouser.co.uk/ProductDetail/Bosch-Sensortec/BMA423?qs=HXFqYaX1Q2xC%252BSgeGoX3mg%3D%3D
IC4 = InkTime_v5:DRV2605YZFR_DRV2605YZFR: Haptic Driver for ERM/LRA with Built-In Library and Smart Loop Architecture Source: Datasheet <http://www.ti.com/lit/gpn/drv2605>; ARROW_PART_NUMBER: DRV2605YZFR; ARROW_PRICE-STOCK: https://www.arrow.com/en/products/drv2605yzfr/texas-instruments?region=nac; DESCRIPTION: Haptic Driver for ERM/LRA with Built-In Library and Smart Loop Architecture; HEIGHT: 0.625mm; MANUFACTURER_NAME: Texas Instruments; MANUFACTURER_PART_NUMBER: DRV2605YZFR
J1 = InkTime_v5:TC2030-IDC_TC2030-IDC: CABLE ADAPTER 6 POS Source: Datasheet <https://datasheet.datasheetarchive.com/originals/distributors/Datasheets_SAMA/62bc384e093448baaaa63dbd0b9d8707.pdf>; DESCRIPTION: CABLE ADAPTER 6 POS; HEIGHT: 19mm; MANUFACTURER_NAME: Tag Connect; MANUFACTURER_PART_NUMBER: TC2030-IDC
J2 = InkTime_v5:503480-2400_503480-2400: FFC & FPC Connectors 0.5mm FPC RA SMT Dual Contact 24Ckt Source: Datasheet <https://componentsearchengine.com/Datasheets/1/503480-2400.pdf>; DESCRIPTION: FFC & FPC Connectors 0.5mm FPC RA SMT Dual Contact 24Ckt; HEIGHT: 1.87mm; MANUFACTURER_NAME: Molex; MANUFACTURER_PART_NUMBER: 503480-2400; MOUSER_PART_NUMBER: 538-503480-2400; MOUSER_PRICE-STOCK: https://www.mouser.co.uk/ProductDetail/Molex/503480-2400?qs=OAhjpuo3Vu7efIoxFh9AOw%3D%3D
J3 = InkTime_v5:KH-TYPE-C-16P_KH-TYPE-C-16P: Check availability <https://pricing.snapeda.com/parts/KH-TYPE-C-16P/kinghelm/view-part?ref=eda>; AVAILABILITY: Not in stock; CHECK_PRICES: https://www.snapeda.com/parts/KH-TYPE-C-16P/Kinghelm/view-part/?ref=eda; MF: kinghelm; MP: KH-TYPE-C-16P; PACKAGE: None; PRICE: None; SNAPEDA_LINK: https://www.snapeda.com/parts/KH-TYPE-C-16P/Kinghelm/view-part/?ref=snap
L1 = InkTime_v5:MLP2016SR47MT0S1_FTC252012SR47MBCA: SMD / SMT Inductors (Coils), L=0.47?H, L x W x T : Source: Datasheet <https://product.tdk.com/system/files/dam/doc/product/inductor/inductor/smd/catalog/inductor_commercial_power_mlp2016_en.pdf>; DESCRIPTION: SMD / SMT Inductors (Coils), L=0.47?H, L x W x T :; HEIGHT: 1mm; JLCPCB: https://jlcpcb.com/partdetail/6763488-FTC252012SR47MBCA/C5832368; MANUFACTURER_NAME: TDK; MANUFACTURER_PART_NUMBER: FTC252012SR47MBCA
L2 = InkTime_v5:ESP32_C6_LIBRARY_2_744043680; COPYRIGHT: Copyright (C) 2024 Ultra Librarian. All rights reserved.; MANUFACTURER_PART_NUMBER: 744043680; MFR_NAME: Wurth Electronics
LL1-LL3 = InkTime_v5:NORDIC_NRF_2_INDUCTOR: Generic chip inductor
P1.01/2.4B = InkTime_v5:NORDIC_NRF_4_NRF52840_QF: nRF52840 Features Advanced Single chip 2.4 GHz multi-protocol SoC 32-bit ARM Cortex-M4F Processor 1.7v to 5.5v operation 1MB flash + 256kB RAM Bluetooth 5 support for long range and high throughput 802.15.4 radio support On-chip NFC PPI –Programmable Peripheral Interconnect Automated power management system with automatic power management of each peripheral Configurable I/O mapping for analog and digital I/O 48 x GPIO 1 x QSPI 4 x Master/Slave SPI 2 x Two-wire interface (I²C) I²S interface 2 x UART 4 x PWM USB 2.0 controller ARM TrustZone CryptoCell-310 Cryptographic and security module AES 128-bit ECB/CCM/AAR hardware accelerator Digital microphone interface (PDM) Quadrature decoder 12-bit ADC Low power comparator On-chip 50Ω balun On-air compatible with nRF52, nRF51 and nRF24 Series Applications Advanced high performance wearables Wearables for secure payments Virtual Reality/Augmented Reality systems Smart Home sensor networks Smart city sensor networks High performance HID controllers Internet of Things (IoT) sensor networks Smart door locks Smart lighting networks Connected white goods
Q1 = InkTime_v5:ESP32_C6_LIBRARY_4_ESP32_WROVER_SPARKFUN-DISCRETESEMI_MOSFET_PCH: P-channel MOSFETs Voltage controlled devices that allow control of high current outputs. SparkFun Products: SparkFun ESP32 Thing <https://www.sparkfun.com/products/13907> SparkFun ESP8266 Thing <https://www.sparkfun.com/products/13231> SparkFun Pi Servo HAT V2 <https://www.sparkfun.com/products/15316> DMG2305UX-7 (20V/4.2A/SOT23-3); PROD_ID: TRAN-14388
Q2 = InkTime_v5:ESP32_C6_LIBRARY_6_SI1308EDL-T1-GE3: MOSFET N-Ch 30V 1.5A TrenchFET SC70 Vishay Si1308EDL-T1-GE3 N-channel MOSFET Transistor, 1.5 A, 30 V, 3-Pin SC-70 Source: Datasheet <https://componentsearchengine.com/Datasheets/1/SI1308EDL-T1-GE3.pdf> Check availability <https://pricing.snapeda.com/parts/SI1308EDL-T1-GE3/Vishay%20Siliconix/view-part?ref=eda>; AVAILABILITY: In Stock; CHECK_PRICES: https://www.snapeda.com/parts/SI1308EDL-T1-GE3/Vishay+Siliconix/view-part/?ref=eda; DESCRIPTION: Si1308EDL-T1-GE3 N-channel MOSFET Transistor, 1.5 A, 30 V, 3-Pin SC-70 | Siliconix / Vishay SI1308EDL-T1-GE3; MF: Vishay Siliconix; MP: SI1308EDL-T1-GE3; PACKAGE: SOT-323 Vishay Semiconductor; PRICE: None; PURCHASE-URL: https://www.snapeda.com/api/url_track_click_mouser/?unipart_id=274603&manufacturer=Vishay Siliconix&part_name=SI1308EDL-T1-GE3&search_term=None; SNAPEDA_LINK: https://www.snapeda.com/parts/SI1308EDL-T1-GE3/Vishay+Siliconix/view-part/?ref=snap
R1-R15 = InkTime_v5:CPF0201D7K68C1_CPF0201D7K68C1: 7.68k 0201 Thin Film Surface Mount Fixed Resistor +/-0.5% 0.031W CPF0201D7K68C1 Source: Datasheet <http://www.te.com/commerce/DocumentDelivery/DDEController?Action=showdoc&DocId=Data Sheet1773200-1ApdfEnglishENG_DS_1773200-1_A.pdf4-2176215-6>
SJ1 = InkTime_v5:ESP32_C6_LIBRARY_7_JUMPER_SJ: SMD solder JUMPER
SW1-SW3 = InkTime_v5:2025-10-22_07-23-44_LIBRARY_EVP-AKE31A; COPYRIGHT: Copyright (C) 2025 Ultra Librarian. All rights reserved.; DIGI-KEY_PART_NUMBER_1: P123437TR-ND; DIGI-KEY_PART_NUMBER_2: P123437CT-ND; DIGI-KEY_PART_NUMBER_3: P123437DKR-ND; MANUFACTURER_NAME: Panasonic; MANUFACTURER_PART_NUMBER: EVP-AKE31A
TP_3V3 TP_SCL TP_SDA TP_SDA1-TP_SDA10 TP_VREG = InkTime_v5:HECTOR_WATCH_1_TP: Test pad
U1 = InkTime_v5:ESP32_C6_LIBRARY_MAX17048G+T10: Check availability <https://pricing.snapeda.com/parts/MAX17048G%2BT10/Analog%20Devices/view-part?ref=eda>; AVAILABILITY: In Stock; CHECK_PRICES: https://www.snapeda.com/parts/MAX17048G+T10/Analog+Devices/view-part/?ref=eda; DESCRIPTION: 3µA 1-Cell/2-Cell Fuel Gauge with ModelGauge; MF: Analog Devices; MP: MAX17048G+T10; PACKAGE: TDFN-8 Maxim; PRICE: None; PURCHASE-URL: https://www.snapeda.com/api/url_track_click_mouser/?unipart_id=329239&manufacturer=Analog Devices&part_name=MAX17048G+T10&search_term=None; SNAPEDA_LINK: https://www.snapeda.com/parts/MAX17048G+T10/Analog+Devices/view-part/?ref=snap
X1 = InkTime_v5:NORDIC_NRF_XTAL_32MHZ
X2 = InkTime_v5:NORDIC_NRF_1_XTAL_32KHZ